# Altium schematic sheet Miscellaneous.SchDoc: <Project Name>
size A3; ApprovedBy: <Appr.>; Author: <Author>; CompanyName: Infineon Technologies AG; Engineer: <Rel.>; Organization: Infineon Technologies AG; Address1: IFAG DES S PS; Address2: Am Campeon 1-12  -  85579 Neubiberg  -  Germany; Address3: 85579 Neubiberg; Address4: Germany; DocumentNumber: 9; Revision: <Rev.>; SheetNumber: 9; SheetTotal: 9; Release: RC00; PageSetup: Record=PageOptions|CenterHorizontal=True|CenterVertical=True|PrintScale=1.01|XCorrection=1.00|YCorrection=1.00|PrintKind=0|BorderSize=5000000|LeftOffset=0|BottomOffset=0|Orientation=2|PaperLength=1000|PaperWidth=1000|Scale=100|PaperSource=7|PrintQuality=-4|MediaType=1|DitherType=10|PaperKind=A3|PrintScaleMode=1; Doc_ConfidentialStatus: <Doc_ConfidentialStatus>; Doc_Preliminary: <Doc_Preliminary>
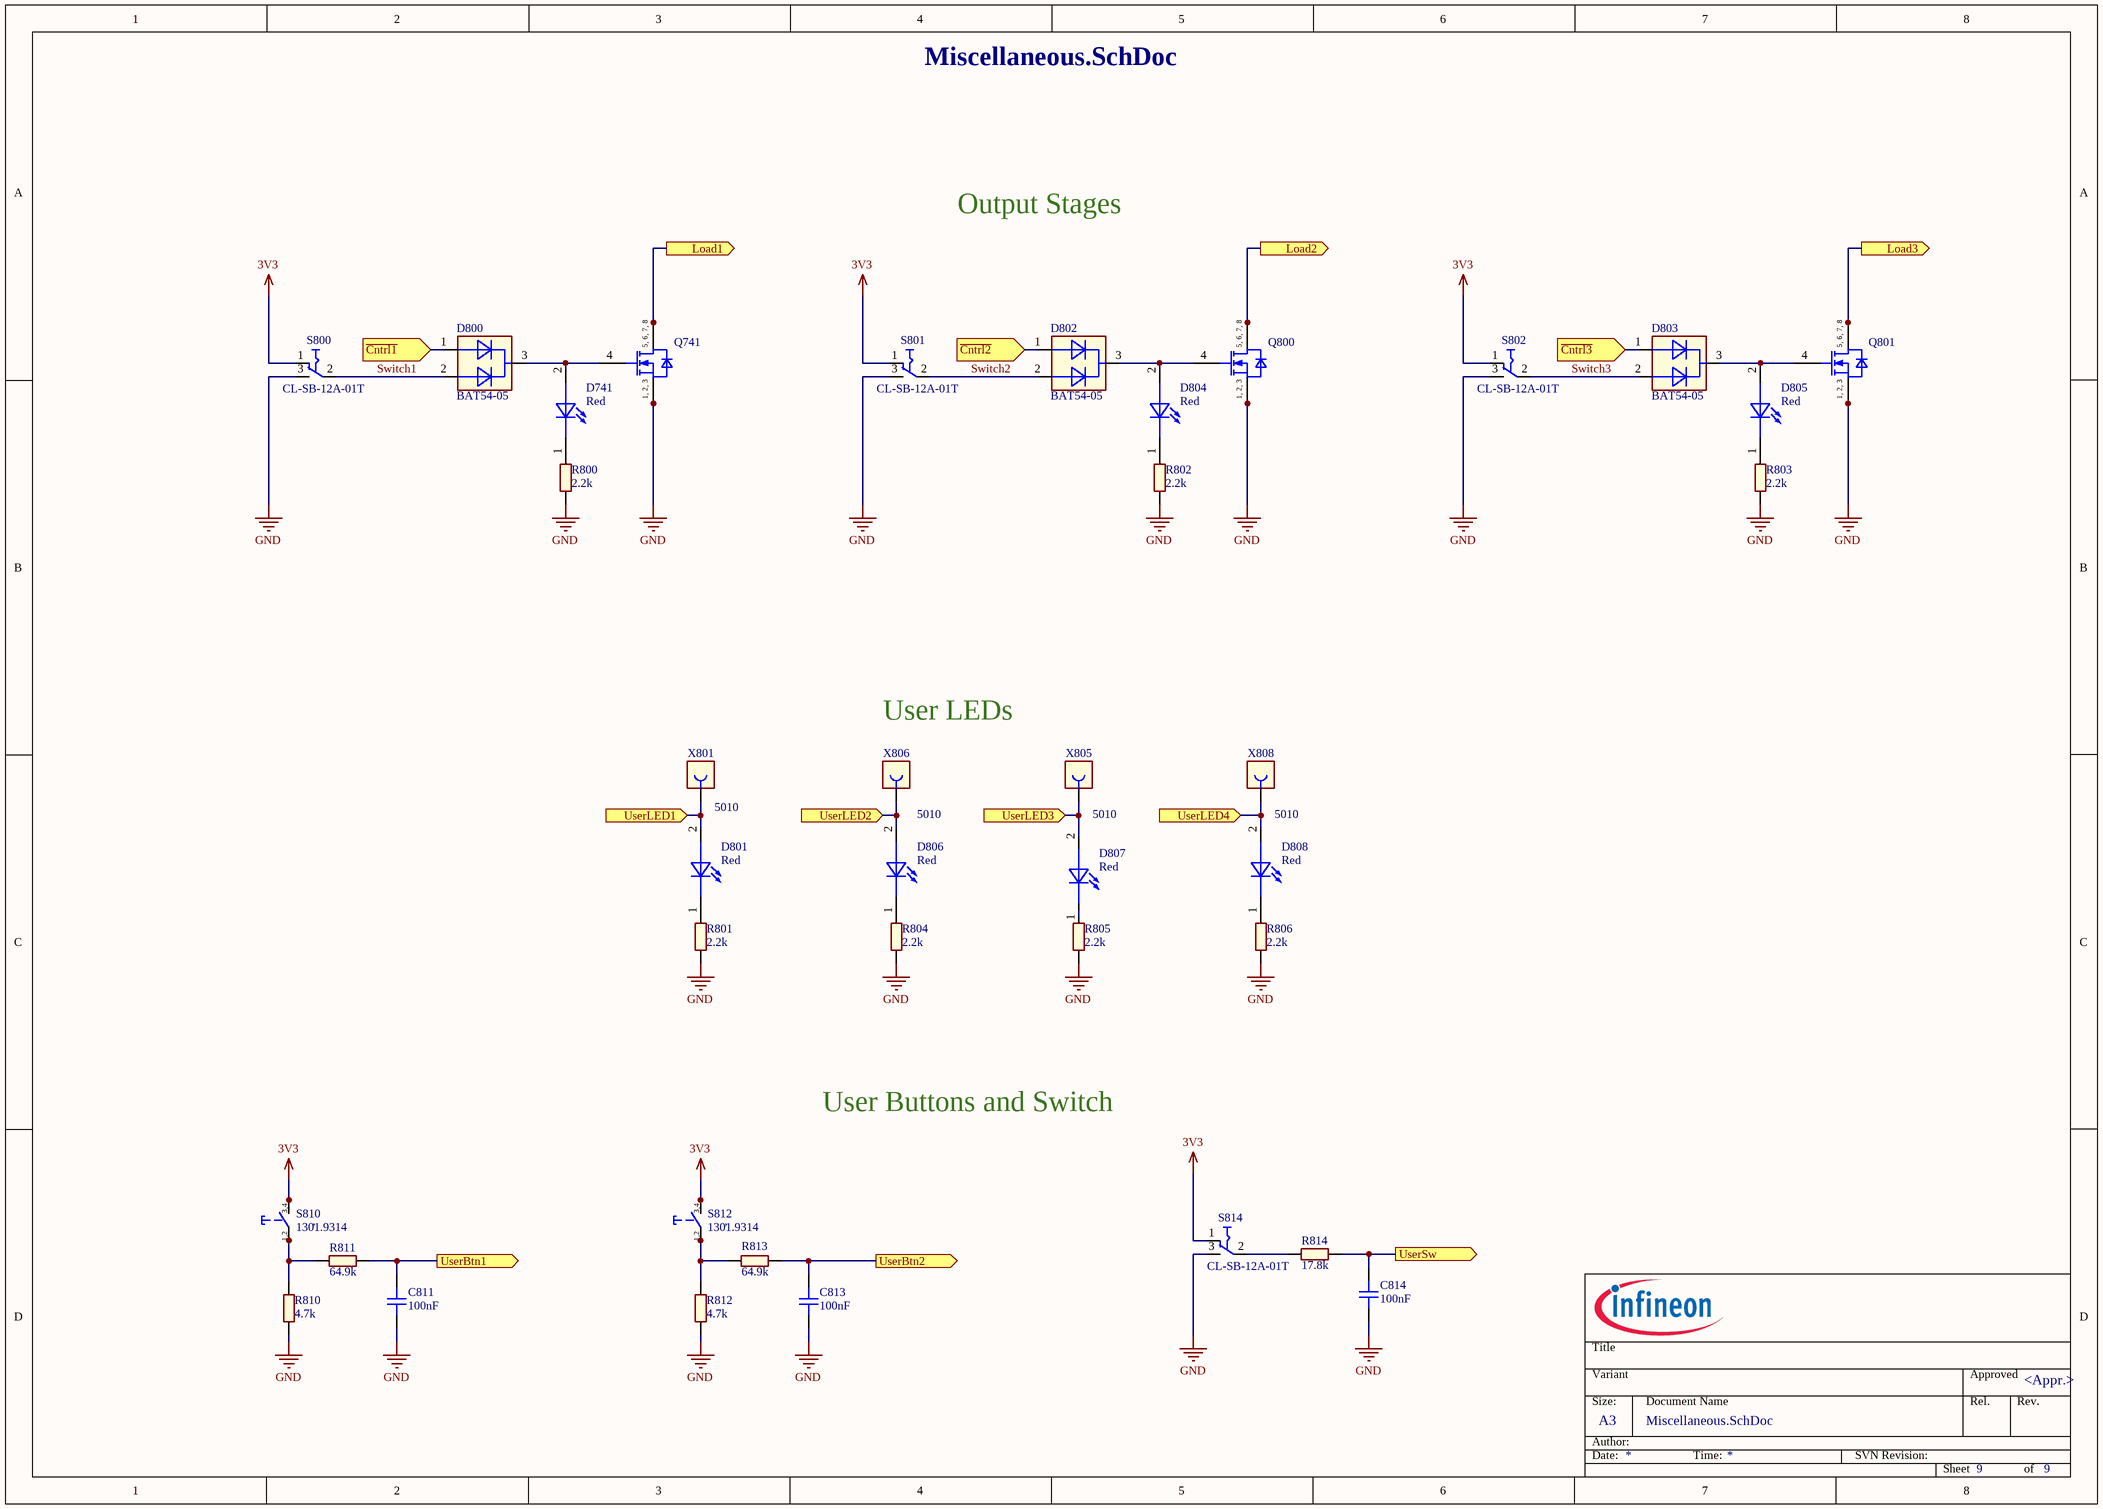
[diagram p0: Miscellaneous.SchDoc]

## Parts
C811  100nF  [CAPC1608X90N-2]
C813  100nF  [CAPC1608X90N-2]
C814  100nF  [CAPC1608X90N-2]
D741  Red  [LEDSC160X80X80-2N-1]
D800  BAT54-05  [SOT95P240X110-3N-1-V]
D801  Red  [LEDSC160X80X80-2N-1]
D802  BAT54-05  [SOT95P240X110-3N-1-V]
D803  BAT54-05  [SOT95P240X110-3N-1-V]
D804  Red  [LEDSC160X80X80-2N-1]
D805  Red  [LEDSC160X80X80-2N-1]
D806  Red  [LEDSC160X80X80-2N-1]
D807  Red  [LEDSC160X80X80-2N-1]
D808  Red  [LEDSC160X80X80-2N-1]
Q741  igfet_n_ch_enh_dio_1s2s3s4g5d6d7d8d_8p  [IFX-PG-TDSON-8-6-V]  (value not drawn)
Q800  igfet_n_ch_enh_dio_1s2s3s4g5d6d7d8d_8p  [IFX-PG-TDSON-8-6-V]  (value not drawn)
Q801  igfet_n_ch_enh_dio_1s2s3s4g5d6d7d8d_8p  [IFX-PG-TDSON-8-6-V]  (value not drawn)
R800  2.2k  [RESC1609X50N]
R801  2.2k  [RESC1609X50N]
R802  2.2k  [RESC1609X50N]
R803  2.2k  [RESC1609X50N]
R804  2.2k  [RESC1609X50N]
R805  2.2k  [RESC1609X50N]
R806  2.2k  [RESC1609X50N]
R810  4.7k  [RESC1609X55N]
R811  64.9k  [RESC1608X60N]
R812  4.7k  [RESC1609X55N]
R813  64.9k  [RESC1608X60N]
R814  17.8k  [RESC1608X60N]
S800  CL-SB-12A-01T  [SW-SMD-CL-SB-12A-01T]
S801  CL-SB-12A-01T  [SW-SMD-CL-SB-12A-01T]
S802  CL-SB-12A-01T  [SW-SMD-CL-SB-12A-01T]
S810  1301.9314  [SW-SMD-1301.9314]
S812  1301.9314  [SW-SMD-1301.9314]
S814  CL-SB-12A-01T  [SW-SMD-CL-SB-12A-01T]
X801  5010  [CON-THT-TP-5010]
X805  5010  [CON-THT-TP-5010]
X806  5010  [CON-THT-TP-5010]
X808  5010  [CON-THT-TP-5010]

## Ports
Load1 (out), Load2 (out), Load3 (out), UserBtn1 (out), UserBtn2 (out), UserLED1 (in), UserLED2 (in), UserLED3 (in), UserLED4 (in), UserSw (out), ~{Cntrl1} (in), ~{Cntrl2} (in), ~{Cntrl3} (in)

## Nets
3V3: S800.1 S801.1 S802.1 S810.3 S810.4 S812.3 S812.4 S814.1
GND: C811.1 C813.1 C814.1 Q741.1(SOURCE) Q741.2(SOURCE) Q741.3(SOURCE) Q800.1(SOURCE) Q800.2(SOURCE) Q800.3(SOURCE) Q801.1(SOURCE) Q801.2(SOURCE) Q801.3(SOURCE) R800.2 R801.2 R802.2 R803.2 R804.2 R805.2 R806.2 R810.2 R812.2 S800.3 S801.3 S802.3 S814.3
~{Cntrl1}: D800.1(ANODE_1) ; port ~{Cntrl1}
~{Cntrl2}: D802.1(ANODE_1) ; port ~{Cntrl2}
~{Cntrl3}: D803.1(ANODE_1) ; port ~{Cntrl3}
Load1: Q741.5(DRAIN) Q741.6(DRAIN) Q741.7(DRAIN) Q741.8(DRAIN) ; port Load1
Load2: Q800.5(DRAIN) Q800.6(DRAIN) Q800.7(DRAIN) Q800.8(DRAIN) ; port Load2
Load3: Q801.5(DRAIN) Q801.6(DRAIN) Q801.7(DRAIN) Q801.8(DRAIN) ; port Load3
Switch1: D800.2(ANODE_2) S800.2
Switch2: D802.2(ANODE_2) S801.2
Switch3: D803.2(ANODE_2) S802.2
UserBtn1: C811.2 R811.2 ; port UserBtn1
UserBtn2: C813.2 R813.2 ; port UserBtn2
UserLED1: D801.2(Anode) X801.1 ; port UserLED1
UserLED2: D806.2(Anode) X806.1 ; port UserLED2
UserLED3: D807.2(Anode) X805.1 ; port UserLED3
UserLED4: D808.2(Anode) X808.1 ; port UserLED4
UserSw: C814.2 R814.2 ; port UserSw
NetD741_1: D741.1(Cathode) R800.1
NetD741_2: D741.2(Anode) D800.3(CATHODE) Q741.4(GATE)
NetD801_1: D801.1(Cathode) R801.1
NetD802_3: D802.3(CATHODE) D804.2(Anode) Q800.4(GATE)
NetD803_3: D803.3(CATHODE) D805.2(Anode) Q801.4(GATE)
NetD804_1: D804.1(Cathode) R802.1
NetD805_1: D805.1(Cathode) R803.1
NetD806_1: D806.1(Cathode) R804.1
NetD807_1: D807.1(Cathode) R805.1
NetD808_1: D808.1(Cathode) R806.1
NetR810_1: R810.1 R811.1 S810.1 S810.2
NetR812_1: R812.1 R813.1 S812.1 S812.2
NetR814_1: R814.1 S814.2

## Notes on the sheet
- Output Stages
- User LEDs
- User Buttons and Switch
- ,
- Title
- Variant
- Approved
- Date:
- Author:
- Size:
- A3
- Document Name
- Time:
- SVN Revision:
- Rel.
- Rev.
- Sheet
- of
- (in symbol 380147) 3,4; 1,2
- (in symbol 691273) 5, 6, 7, 8; 1, 2, 3

## Library data of the parts
C811 C813 C814 = 479045: CAP / CERA / 100nF / 50V / 10% / X7R (EIA) / -55°C to 125°C / 0603 / SMD / -; Multiple Parts: No; Manufacturer: AVX; Manufacturer Order Number: 06035C104KAT2A; Symbol Type: Capacitor; Single; Standard; 2 Pins; Alternate View: Yes; Article Number: 479045; Version Number: V01; Combined Parameters: TC:X7R (EIA);Tol.:-10%/+10%;Vdc:50V; QuickPick: 100nF / 50V / 10% / X7R (EIA) / 0603; Type: Standard; Style: Single; ComponentStatus: Released; PLMStatus: Active; Part Type: Capacitor; Value: 100nF; Tolerance Neg: 10%; Tolerance Pos: 10%; Application: Standard; Technology: Ceramic; Temperature min: -55; Temperature max: 125; Temperature Range: Military; ROHS Compliant: Y; Automotive Qualified: No; PackageReference: 0603; ComponentLink1Description: Vendor WebSite; ComponentLink1URL: http://www.avx.com; ComponentLink2Description: Datasheet; ComponentLink2URL: http://webnetprod.muc.infineon.com/PCBPortal_Prod/WorkFlows/AltiumComponent/StandardDocumentation?Versionid=479046; Supplier 1: Farnell; Supplier Part Number 1: 2280883; Supplier 2: DigiKey; Supplier Part Number 2: 478-5052-2-ND; Supplier 3: Mouser; Supplier Part Number 3: 581-06035C104KAT2A; Second Source allowed: Yes; Voltage DC (max): 50V; Package Description: Capacitor,non-polarized,Chip;1.60mm L X 0.81mm W X 0.90mm H
D741 D801 D804-D808 = 625459: WL-SMCW SMT Mono-color Chip LED Waterclear, Red,630nm; Manufacturer: Wurth Elektronik; Manufacturer Order Number: 150060RS75000; Symbol Type: Standard LED Symbol, 1 Cathode, 2 Anode; Article Number: 625459; Version Number: V01; Combined Parameters: Vf:2.4V;If:30mA;Ur:5V;Ir:10uA;Pmax:72mW; QuickPick: LED / 1608 (0603); Style: Single; Automotive Qualified: No; ComponentStatus: Released; PLMStatus: Active; Second Source allowed: Yes; Voltage DC (max): na; Part Type: Diode; Value: Red; Type: LED; Application: Standard; Temperature min: -40; Temperature max: 85; Temperature Range: Industrial; ROHS Compliant: Y; PackageReference: 1608 (0603); ComponentLink1Description: Vendor WebSite; ComponentLink1URL: http://www.we-online.com; ComponentLink2Description: Datasheet; ComponentLink2URL: http://webnetprod.muc.infineon.com/PCBPortal_Prod/WorkFlows/AltiumComponent/StandardDocumentation?Versionid=625460; Supplier 1: Farnell; Supplier Part Number 1: 2322071; Supplier 2: DigiKey; Supplier Part Number 2: 732-4978-1-ND; Supplier 3: Mouser; Supplier Part Number 3: 710-150060RS75000; Package Description: LED,Side Concave; 2 pin,1.60mm W X 0.80mm L X 0.80mm H
D800 D802 D803 = 430837: Silicon Schottky Diode, LS(nH) 1.8, VR 30V; Legacy PartNumber: IFX01401370; Manufacturer: Infineon Technologies; Symbol type: Dual Diode Symbol 3 Pins, 1 Anode, 2 Anode, 3 Cathode; Article Number: 430837; Version Number: V01; Combined Parameters: Vf:800mV;If:200mA;Ur:30V;Ir:2uA;Pmax:230mW; QuickPick: Schottky Diode / PG-SOT23-3-11; Style: Dual; Automotive Qualified: AEC Q101; ComponentStatus: Released; PLMStatus: Active; Second Source allowed: Yes; Voltage DC (max): na; Legacy DeviceID: IFX01401370; Part Type: Diode; Manufacturer Order Number: BAT54-05; Value: BAT54-05; Type: Schottky Diode; Application: Standard; Temperature min: 0; Temperature max: 150; Temperature Range: Military; ROHS Compliant: Y; PackageReference: PG-SOT23-3-11; ComponentLink1Description: Vendor WebSite; ComponentLink1URL: https://www.infineon.com/; ComponentLink2Description: Datasheet; ComponentLink2URL: http://webnetprod.muc.infineon.com/PCBPortal_Prod/WorkFlows/AltiumComponent/StandardDocumentation?Versionid=430838; Supplier 1: Farnell; Supplier Part Number 1: 2725759; Supplier 2: DigiKey; Supplier Part Number 2: BAT5405E6327HTSA1TR-ND; Supplier 3: Mouser; Supplier Part Number 3: 726-BAT5405E6327HTSA; Package Description: SOT,0.95mm pitch;3 pin,1.30mm W X 2.90mm L X 1.10mm H body
Q741 Q800 Q801 = 691273: OptiMOS Power MOSFET, 30V; Manufacturer: Infineon Technologies; Manufacturer Order Number: BSC0906NS; Symbol Type: Insulated-Gate Field-Effect Transistor (IGFET), N-Channel, Enhancement, Body Diode, Pin 1 Source, 2 Source, 3 Source, 4 Gate, 5 Drain, 6 Drain, 7 Drain, 8 Drain, 8 Pins; Article Number: 691273; Version Number: V00; Legacy DeviceID: IFX_BSC0906NS; Value: BSC0906NS; Combined Parameters: N-Channel Enhancement;Uds:30V;Id:63A;Rds:4.5R;P:30W; QuickPick: N-Channel Enhancement / 30W / 63A / 30V / TDSON-8; Type: N-Channel Enhancement; Style: Single; Automotive Qualified: No; ComponentStatus: Released; PLMStatus: Active; Second Source allowed: Yes; Voltage DC (max): na; Part Type: Transistor FET; Application: Power Electronics; Temperature min: -55; Temperature max: 150; Temperature Range: Military; ROHS Compliant: Y; PackageReference: TDSON-8; ComponentLink1Description: Vendor WebSite; ComponentLink1URL: https://www.infineon.com/; ComponentLink2Description: Datasheet; ComponentLink2URL: http://webnetprod.muc.infineon.com/PCBPortal_Prod/WorkFlows/AltiumComponent/StandardDocumentation?Versionid=691274; Supplier 1: Farnell; Supplier Part Number 1: 2480745; Supplier 2: DigiKey; Supplier Part Number 2: BSC0906NSATMA1CT-ND; Supplier 3: Mouser; Supplier Part Number 3: 726-BSC0906NS; Package Description: PG-TDSON-8-6, SMD, 1.27 mm pitch, 8 pin, 5.90 mm W X 5.075 mm L X 1.20 mm H body
R800-R806 = 345782: RES / STD / 2.2k / 100mW / 1% / 100ppm/K / -55°C to 155°C / 0603 / SMD / -; Multiple Parts: No; Legacy PartNumber: RES01801179; Manufacturer: Vishay; Manufacturer Order Number: CRCW06032K20FK; Symbol Type: Resistor; Single; Standard; 2 Pins; Alternate View: Yes; Article Number: 345782; Version Number: V01; Combined Parameters: TCR:100ppm/K;Tol.:-1%/+1%;Vdc:75V;Idc:-;P:100mW; QuickPick: 2.2k / 1% / 0.1 / 0603; Style: Single; Automotive Qualified: AEC Q200; ComponentStatus: Released; PLMStatus: Active; Voltage DC (max): 75V; Legacy DeviceID: RES01801179; Part Type: Resistor; Value: 2.2k; Tolerance Neg: 1%; Tolerance Pos: 1%; Type: Standard; Technology: Thick Film; Temperature min: -55; Temperature max: 155; Temperature Range: Military; ROHS Compliant: Y; PackageReference: 0603; ComponentLink1Description: Vendor WebSite; ComponentLink1URL: http://www.vishay.com; ComponentLink2Description: Datasheet; ComponentLink2URL: http://webnetprod.muc.infineon.com/PCBPortal_Prod/WorkFlows/AltiumComponent/StandardDocumentation?Versionid=345783; Supplier 1: Farnell; Supplier 2: DigiKey; Supplier 3: Mouser; Second Source allowed: Yes
R810 R812 = 699381: RES / STD / 4.7k / 100mW / 1% / 100ppm/K / -55°C to 155°C / 1.60mm L X 0.85mm W X 0.55mm H / - / -; Multiple Parts: No; Manufacturer: Panasonic; Manufacturer Order Number: ERJ3EKF4701V; Symbol Type: Resistor; Single; Standard; 2 Pins; Alternate View: Yes; Article Number: 699381; Version Number: V00; Combined Parameters: TCR:100ppm/K;Tol.:-1%/+1%;Vdc:-;Idc:-;P:100mW; QuickPick: 4.7k / 1% / 0.1 / ERJ3EKF4701V; Style: Single; Automotive Qualified: AEC Q200; ComponentStatus: Released; PLMStatus: Active; Part Type: Resistor; Value: 4.7k; Tolerance Neg: 1%; Tolerance Pos: 1%; Type: Standard; Application: Standard; Technology: Thick Film; Temperature min: -55; Temperature max: 155; Temperature Range: Military; ROHS Compliant: Y; PackageReference: ERJ3EKF4701V; ComponentLink1Description: Vendor WebSite; ComponentLink1URL: http://panasonic.net/sanyo/index.html; ComponentLink2Description: Datasheet; ComponentLink2URL: http://webnetprod.muc.infineon.com/PCBPortal_Prod/WorkFlows/AltiumComponent/StandardDocumentation?Versionid=699382; Supplier 1: Farnell; Supplier Part Number 1: 2303181; Supplier 2: DigiKey; Supplier Part Number 2: P4.70KHCT-ND; Supplier 3: Mouser; Supplier Part Number 3: 667-ERJ-3EKF4701V; Second Source allowed: Yes; Package Description: Resistor,Chip;1.60mm L X 0.85mm W X 0.55mm H
R811 R813 = 699501: RES / STD / 64.9k / 100mW / 1% / 100ppm/K / -55°C to 155°C / 1.60mm L X 0.80mm W X 0.60mm H / - / -; Multiple Parts: No; Manufacturer: Multicomp; Manufacturer Order Number: MCWR06X6492FTL; Symbol Type: Resistor; Single; Standard; 2 Pins; Alternate View: Yes; Article Number: 699501; Version Number: V00; Combined Parameters: TCR:100ppm/K;Tol.:-1%/+1%;Vdc:-;Idc:-;P:100mW; QuickPick: 64.9k / 1% / 0.1 / MCWR06X6492FTL; Style: Single; ComponentStatus: Released; PLMStatus: Active; Part Type: Resistor; Value: 64.9k; Tolerance Neg: 1%; Tolerance Pos: 1%; Type: Standard; Application: Standard; Technology: Thick Film; Temperature min: -55; Temperature max: 155; Temperature Range: Military; ROHS Compliant: Y; Automotive Qualified: No; PackageReference: MCWR06X6492FTL; ComponentLink1Description: Vendor WebSite; ComponentLink1URL: http://www.farnellinone.com; ComponentLink2Description: Datasheet; ComponentLink2URL: http://webnetprod.muc.infineon.com/PCBPortal_Prod/WorkFlows/AltiumComponent/StandardDocumentation?Versionid=699502; Supplier 1: Farnell; Supplier Part Number 1: 2447417RL; Supplier 2: DigiKey; Supplier 3: Mouser; Second Source allowed: Yes; Package Description: Resistor,Chip;1.60mm L X 0.80mm W X 0.60mm H
R814 = 699489: RES / STD / 17.8k / 100mW / 1% / 100ppm/K / -55°C to 155°C / 1.60mm L X 0.80mm W X 0.60mm H / - / -; Multiple Parts: No; Manufacturer: Multicomp; Manufacturer Order Number: MCWR06X1782FTL; Symbol Type: Resistor; Single; Standard; 2 Pins; Alternate View: Yes; Article Number: 699489; Version Number: V00; Combined Parameters: TCR:100ppm/K;Tol.:-1%/+1%;Vdc:-;Idc:-;P:100mW; QuickPick: 17.8k / 1% / 0.1 / MCWR06X1782FTL; Style: Single; ComponentStatus: Released; PLMStatus: Active; Part Type: Resistor; Value: 17.8k; Tolerance Neg: 1%; Tolerance Pos: 1%; Type: Standard; Application: Standard; Technology: Thick Film; Temperature min: -55; Temperature max: 155; Temperature Range: Military; ROHS Compliant: Y; Automotive Qualified: No; PackageReference: MCWR06X1782FTL; ComponentLink1Description: Vendor WebSite; ComponentLink1URL: http://www.farnellinone.com; ComponentLink2Description: Datasheet; ComponentLink2URL: http://webnetprod.muc.infineon.com/PCBPortal_Prod/WorkFlows/AltiumComponent/StandardDocumentation?Versionid=699490; Supplier 1: Farnell; Supplier Part Number 1: 2447265; Supplier 2: DigiKey; Supplier 3: Mouser; Second Source allowed: Yes; Package Description: Resistor,Chip;1.60mm L X 0.80mm W X 0.60mm H
S800-S802 S814 = 650099: Slid Switch, 12V, 200mA; Manufacturer: NIDEC COPAL ELECTRONICS, Inc.; Symbol Type: Switch, 2 Change Over 1 3, 3 Pins; Article Number: 650099; Version Number: V00; Automotive Qualified: No; ComponentStatus: Released; PLMStatus: Active; Second Source allowed: Yes; Voltage DC (max): na; Part Type: Electro Mechanic; Manufacturer Order Number: CL-SB-12A-01T; Value: CL-SB-12A-01T; Application: Power; Temperature min: -40; Temperature max: 85; Temperature Range: Industrial; ROHS Compliant: Y; ComponentLink1Description: Vendor WebSite; ComponentLink1URL: www.copal-electronics.com/; ComponentLink2Description: Datasheet; ComponentLink2URL: http://webnetprod.muc.infineon.com/PCBPortal_Prod/WorkFlows/AltiumComponent/StandardDocumentation?Versionid=650100; Supplier 1: Farnell; Supplier Part Number 1: 2854744; Supplier 2: DigiKey; Supplier Part Number 2: 563-1314-1-ND; Supplier 3: Mouser; Supplier Part Number 3: 229-CL-SB-12A-01T; Package Description: Switch, SMD, 3 Pins, 3.50 mm W X 8.50 mm L X 6.10 mm H body
S810 S812 = 380147: Pushbutton Tactile Switch, Single Pole Single Throw, 4 Pins; Legacy PartNumber: CON01500305; Manufacturer: Schurter; Symbol type: Tactile Switch, Spring Return, Single Pole Single Throw - Normally Open, 4 Pins; Article Number: 380147; Version Number: V01; Legacy DeviceID: SCH_1301.9314; ComponentStatus: Released; PLMStatus: Active; Second Source allowed: Yes; Voltage DC (max): na; Part Type: Electro Mechanic; Manufacturer Order Number: 1301.9314; Value: 1301.9314; Temperature min: -20; Temperature max: 70; Temperature Range: Commercial; ROHS Compliant: Y; ComponentLink1Description: Vendor WebSite; ComponentLink1URL: http://www.schurter.com.sg/; ComponentLink2Description: Datasheet; ComponentLink2URL: http://webnetprod.muc.infineon.com/PCBPortal_Prod/WorkFlows/AltiumComponent/StandardDocumentation?Versionid=380148; Supplier 1: Farnell; Supplier Part Number 1: 1217763; Supplier 2: DigiKey; Supplier Part Number 2: 1301.9314-ND; Supplier 3: Mouser; Supplier Part Number 3: 693-1301.9314; Package Description: SMD Switch, 6.00mm L X 6.00mm W X 4.3mm H body
X801 X805 X806 X808 = 382400: PC Test Point-Multipurpose THT, Red; Multiple Parts: No; Legacy PartNumber: CON01500529; Manufacturer: Keystone Electronics Corp.; Symbol Type: Connector, 1 Lead, Female; Alternate View: Yes; Article Number: 382400; Version Number: V01; Legacy DeviceID: KEY_5010; Combined Parameters: Board-to-Cable None (onboard);1x1;Mounting:THT;Orient:0° (vertical);Shielded:No; QuickPick: 0° (vertical) / Board-to-Cable; Style: Not Applicable; ComponentStatus: Released; PLMStatus: Active; Voltage DC (max): na; Part Type: Connector; Manufacturer Order Number: 5010; Value: 5010; Type: Board-to-Cable; Application: Test; Temperature min: 0; Temperature max: 0; Temperature Range: Military; ROHS Compliant: Y; Automotive Qualified: No; ComponentLink1Description: Vendor WebSite; ComponentLink1URL: http://www.keyelco.com/; ComponentLink2Description: Datasheet; ComponentLink2URL: http://webnetprod.muc.infineon.com/PCBPortal_Prod/WorkFlows/AltiumComponent/StandardDocumentation?Versionid=382401; Supplier 1: Farnell; Supplier Part Number 1: 2301288; Supplier 2: DigiKey; Supplier Part Number 2: 36-5010-ND; Supplier 3: Mouser; Supplier Part Number 3: 534-5010; Second Source allowed: Yes; Package Description: Test Point, 1.78 mm Lead Width, Round, 3.17 mm Dia X 8.28 mm H body